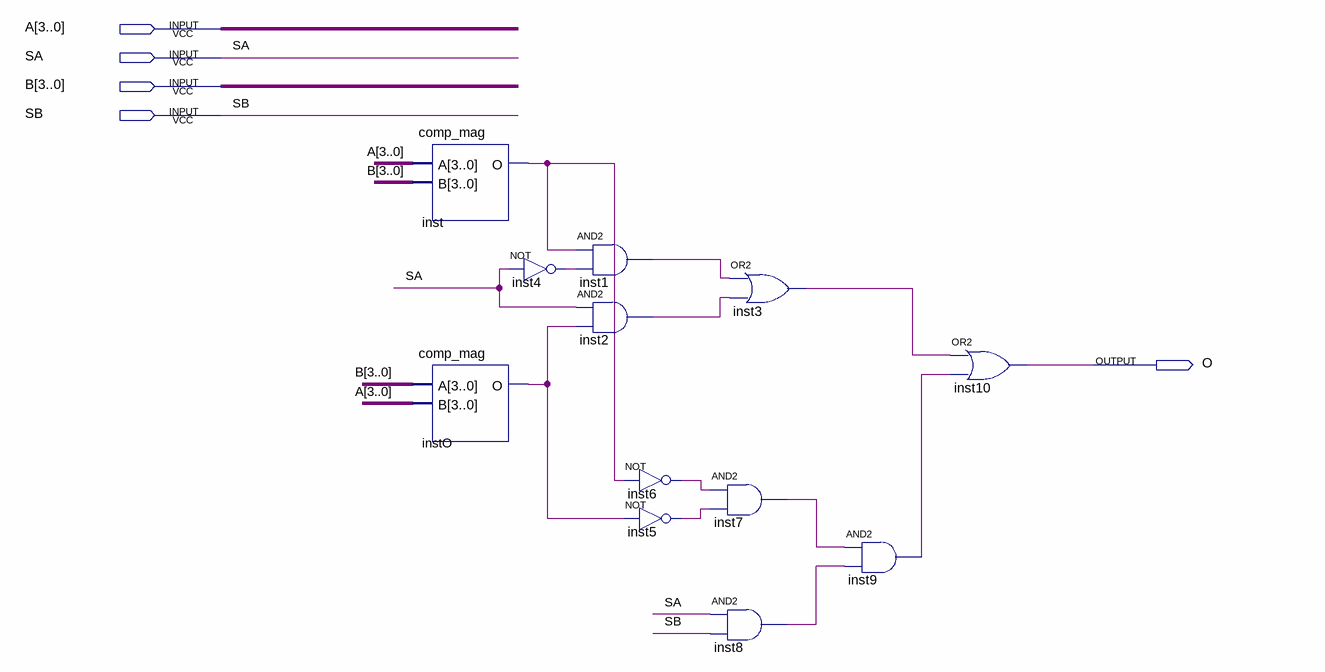
[diagram p0: schematic sheet]
// Quartus schematic comp_maior.bdf as structural Verilog: 12 symbols, 5 pins
module comp_maior (
  input  [3:0] A,
  input  SA,
  input  [3:0] B,
  input  SB,
  output O
);

  wire inst1_out, inst2_out, inst3_out, inst4_out, inst5_out, inst6_out, inst7_out, inst8_out, inst9_out,
       inst_o, instO_o;

  comp_mag inst (.A(A), .B(B), .O(inst_o));
  comp_mag instO (.A(B), .B(A), .O(instO_o));
  not inst4 (inst4_out, SA);
  and inst1 (inst1_out, inst_o, inst4_out);
  and inst2 (inst2_out, SA, instO_o);
  not inst6 (inst6_out, inst_o);
  not inst5 (inst5_out, instO_o);
  or inst3 (inst3_out, inst1_out, inst2_out);
  and inst7 (inst7_out, inst6_out, inst5_out);
  and inst8 (inst8_out, SA, SB);
  and inst9 (inst9_out, inst7_out, inst8_out);
  or inst10 (O, inst3_out, inst9_out);
endmodule
